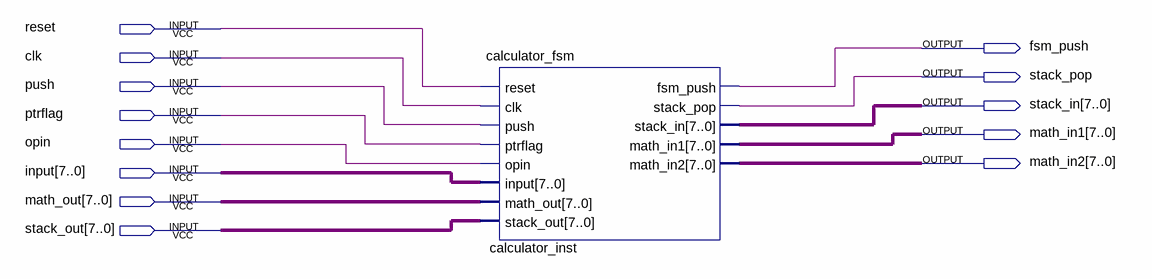
[diagram p0: schematic sheet]
// Quartus schematic bc.bdf as structural Verilog: 1 symbols, 13 pins
module bc (
  input  reset,
  input  clk,
  input  push,
  input  ptrflag,
  input  opin,
  input  [7:0] \input ,
  input  [7:0] math_out,
  input  [7:0] stack_out,
  output fsm_push,
  output stack_pop,
  output [7:0] stack_in,
  output [7:0] math_in1,
  output [7:0] math_in2
);

  calculator_fsm calculator_inst (
    .reset(reset), .clk(clk), .push(push), .ptrflag(ptrflag), .opin(opin), .\input (\input ),
    .math_out(math_out), .stack_out(stack_out), .fsm_push(fsm_push), .stack_pop(stack_pop),
    .stack_in(stack_in), .math_in1(math_in1), .math_in2(math_in2));
endmodule
